# EAGLE design MRCS-Telephone-Connector-V2.0 (EAGLE 7.7.0)
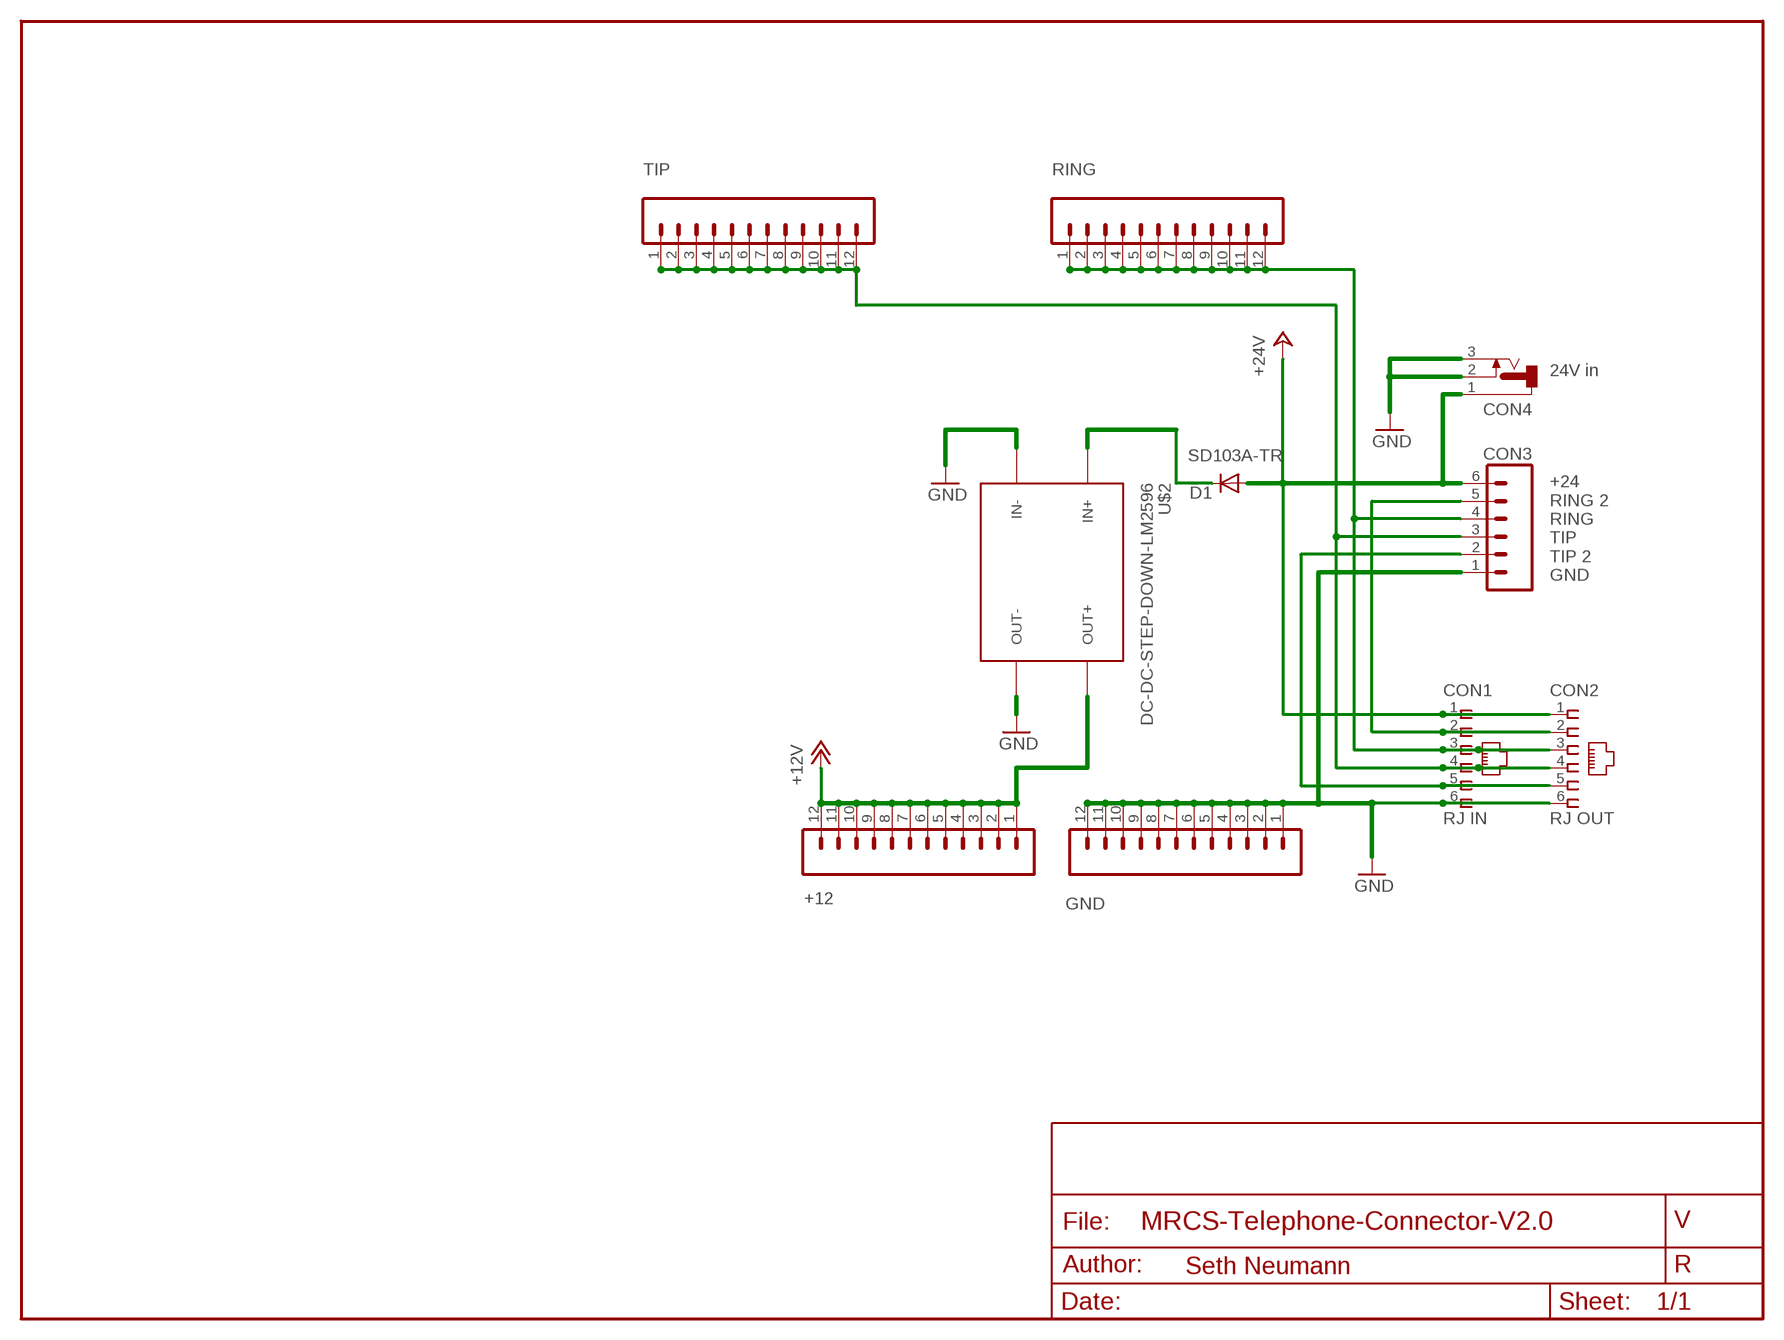
[diagram p0: schematic, sheet 1]

## Parts
+12  CONNECTOR-M12LOCK  [1X12_LOCK]
CON1  RJ IN  CONNECTOR-RJ25-43860-2-MOLEX  [RJ25-INVERTED]
CON2  RJ OUT  CONNECTOR-RJ25-43860-2-MOLEX  [RJ25-INVERTED]
CON3  CONNECTOR-M06LOCK  [1X06_LOCK]
CON4  CONNECTOR-DC-POWER-RA  [DCJ0202]
D1  SD103A-TR  DIODEPTH  [DIODE-1N4001]
GND  CONNECTOR-M12LOCK  [1X12_LOCK]
RING  CONNECTOR-M12LOCK  [1X12_LOCK]
TIP  CONNECTOR-M12LOCK  [1X12_LOCK]
U$2  DC-DC-STEP-DOWN-LM2596  [DC-DC-STEP-DOWN-LM2596]

## Nets
+12V: +12.1 +12.2 +12.3 +12.4 +12.5 +12.6 +12.7 +12.8 +12.9 +12.10 +12.11 +12.12 U$2.OUT+
+24V: CON1.1 CON2.1 CON3.6 CON4.1 D1.A
GND: CON1.6 CON2.6 CON3.1 CON4.2 CON4.3 GND.1 GND.2 GND.3 GND.4 GND.5 GND.6 GND.7 GND.8 GND.9 GND.10 GND.11 GND.12 U$2.IN- U$2.OUT-
N$1: D1.C U$2.IN+
RING: CON1.3 CON2.3 CON3.4 RING.1 RING.2 RING.3 RING.4 RING.5 RING.6 RING.7 RING.8 RING.9 RING.10 RING.11 RING.12
RING2: CON1.2 CON2.2 CON3.5
TIP: CON1.4 CON2.4 CON3.3 TIP.1 TIP.2 TIP.3 TIP.4 TIP.5 TIP.6 TIP.7 TIP.8 TIP.9 TIP.10 TIP.11 TIP.12
TIP2: CON1.5 CON2.5 CON3.2

## Notes on the sheet
- 24V in
- +24
  RING 2
  RING
  TIP
  TIP 2
  GND
- Seth Neumann

## Library data of the parts
+12 GND RING TIP = SPCoast:CONNECTOR-M12: Header 12 Standard 12-pin 0.1" header. Use with straight break away headers (SKU : PRT-00116), right angle break away headers (PRT-00553), swiss pins (PRT-00743), machine pins (PRT-00117), and female headers (PRT-00115).
CON1 CON2 = SPCoast:CONNECTOR-RJ25: AMP connector
CON3 = SPCoast:CONNECTOR-M06: Header 6 Standard 6-pin 0.1" header
CON4 = SPCoast:CONNECTOR-DC-POWER: DC POWER JACK
D1 = SPCoast:DIODE: Diode These are standard reverse protection diodes and small signal diodes. SMA package can handle up to about 1A. SOD-323 can handle about 200mA. What the SOD-323 package when ordering, there are some mfgs out there that are 5-pin packages.
U$2 = diy-modules:DC-DC-STEP-DOWN-LM2596: DC/DC Step-Down Regulator based on LM2596-ADJ chip LM2596 datasheet available here: http://www.ti.com/lit/ds/symlink/lm2596.pdf Click here to find device on ebay.com <http://www.ebay.com/sch/lm2596+power+regulator>

## Net classes
0 default: width 0.254 mm, clearance 0.254 mm
1 Power: width 0.406 mm, clearance 0.254 mm
2 Phone: width 0.305 mm, clearance 0.381 mm
3 Nasty Loads: width 0.61 mm, clearance 0.61 mm

## Board
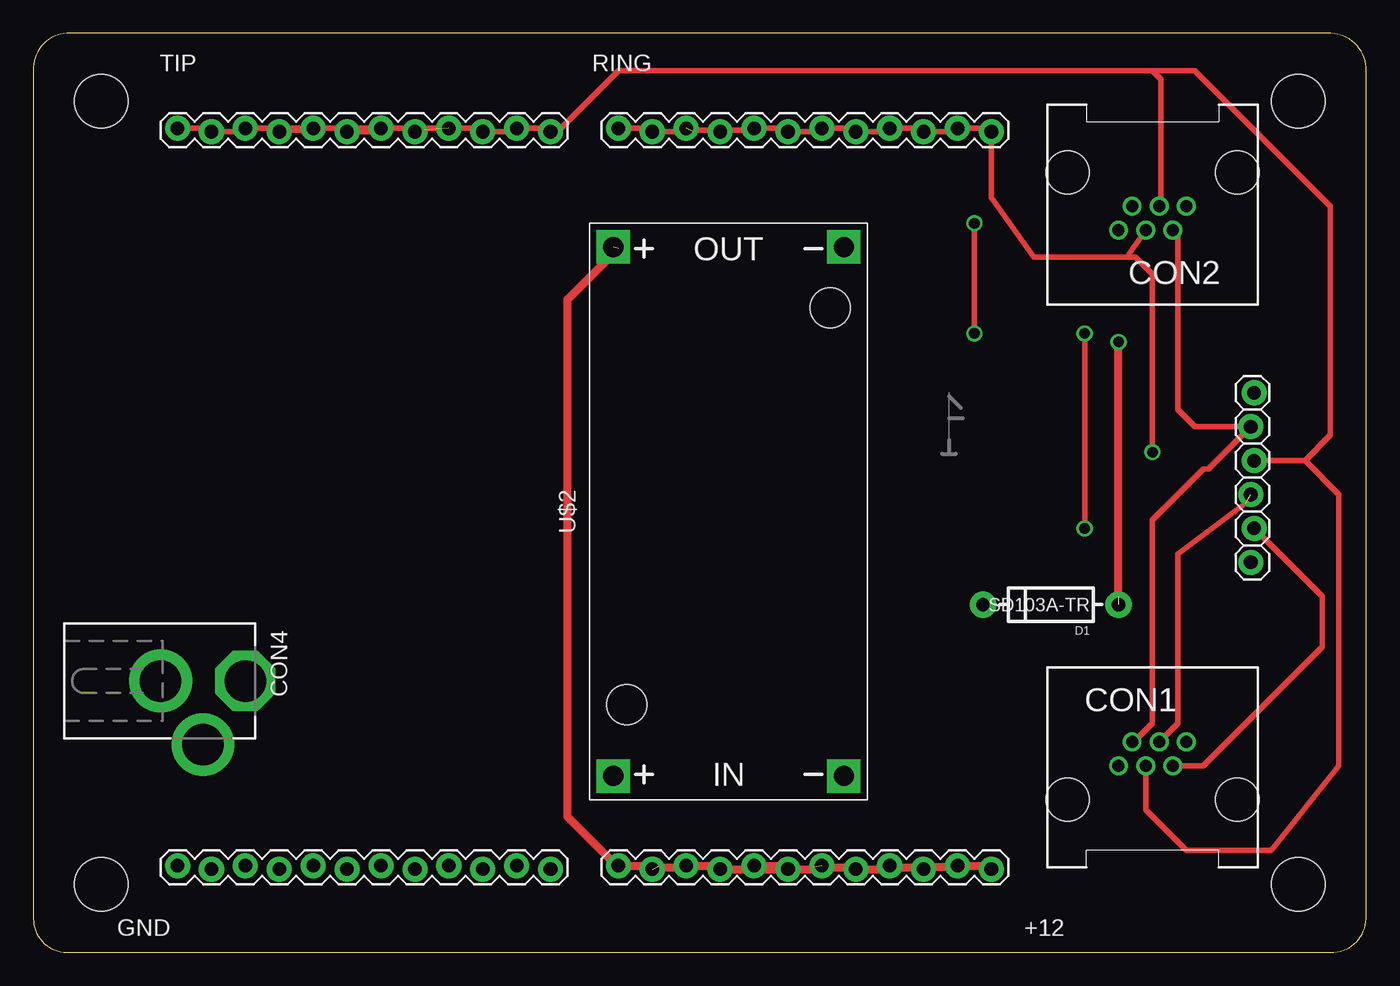
[diagram p1: board, top side]
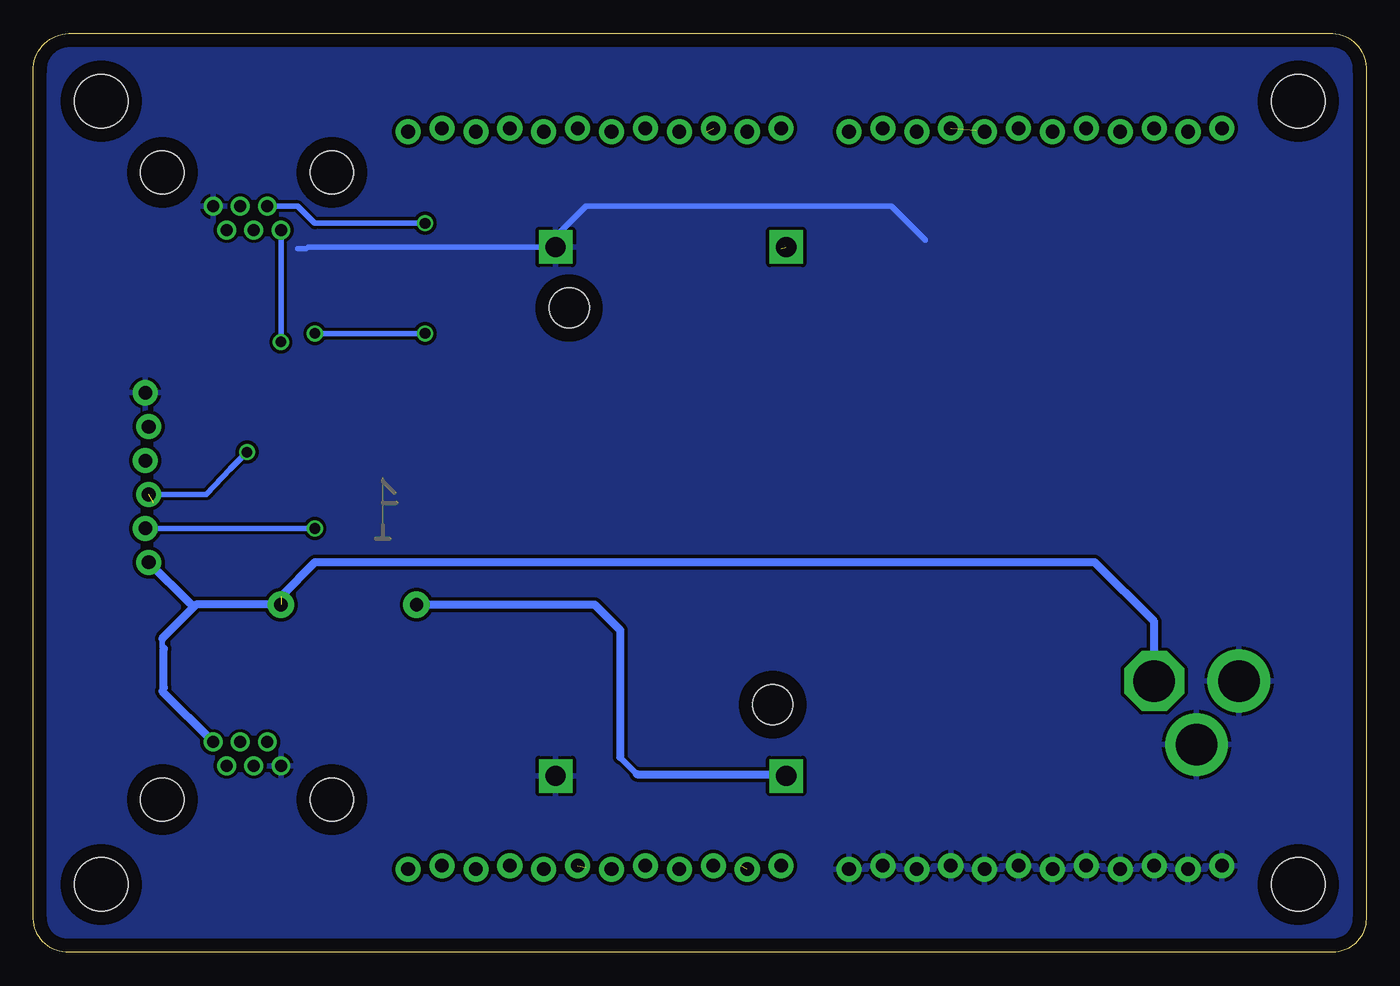
[diagram p2: board, bottom side, seen from below]

Size 99.82 x 68.83 mm. Coordinates in mm from the lower left corner, seen from the top.
Copper layers (1*16): Top 0.035mm / dielectric 1.5mm / Bottom 0.035mm
Design rules "default": minimum track width 10mil, minimum drill 24mil, track to track 8mil, track to pad 8mil, pad to pad 8mil, via to via 8mil, smd to smd 8mil, copper to edge 40mil, drill to drill 8mil, minimum pad ring 10mil, minimum via ring 8mil, stop-mask expansion 4mil, vias tented up to drill 0mil, thermal gap 10mil

### Footprints (pad centres in the part's own frame; a part is rotated, then mirrored left to right if it is on the bottom)
1X12_LOCK = drill 1.016 pad 1.88: 1 0,0.127; 2 2.54,-0.127; 3 5.08,0.127; 4 7.62,-0.127; 5 10.16,0.127; 6 12.7,-0.127; 7 15.24,0.127; 8 17.78,-0.127; 9 20.32,0.127; 10 22.86,-0.127; 11 25.4,0.127; 12 27.94,-0.127
RJ25-INVERTED = drill 0.9 pad 1.4: 1 2.54,4.318; 2 1.524,2.54; 3 0.508,4.318; 4 -0.508,2.54; 5 -1.524,4.318; 6 -2.54,2.54 | hole 3.251: -6.35,0; 6.35,0
1X06_LOCK = drill 1.016 pad 1.88: 1 0,0; 2 2.54,-0.254; 3 5.08,0; 4 7.62,-0.254; 5 10.16,0; 6 12.7,-0.254
DCJ0202 = drill 3.1 pad 4.5 octagon: 1 0,3.175 | drill 3.1 pad 4.7: 2 4.763,0; 3 0,-3.175
DIODE-1N4001 = drill 1 pad 1.981: A 5.08,0; C -5.08,0
BOARD-DINRAIL-2.71IN-MRCS = hole 4: 94.742,5.08; 5.08,63.754; 94.742,63.754; 5.08,5.08
DC-DC-STEP-DOWN-LM2596 = drill 1.5 pad 2.5 square: IN+ -19.812,8.636; IN- -19.812,-8.636; OUT+ 19.812,8.636; OUT- 19.812,-8.636 | hole 3: -14.478,7.62; 15.24,-7.62

### Placement (x,y rotation side)
+12  43.82,6.35 0 top
CON1  83.82,11.43 0 top
CON2  83.82,58.42 180 top
CON3  91.44,41.91 270 top
CON4  12.7,20.32 270 top
D1  76.2,26.04 0 top
GND  10.8,6.35 0 top
RING  43.82,61.59 0 top
TIP  10.8,61.59 0 top
U$1  [BOARD-DINRAIL-2.71IN-MRCS]  0,0 0 top
U$2  52.07,33.02 90 top
U$4  [MRCSLOGOTOP]  67.31,36.83 0 top
U$5  [MRCSLOGOBTM]  67.31,30.48 0 top
U$6  [CA-PROP65WARNING]  64.77,39.37 0 top

### Tracks (layer width: path | path; a pad name or v marks a point on that pad's centre or on a via)
+12V  (3 unrouted)
  Top 0.406: +12.1 43.69,6.48 | 46.87,6.48 46.99,6.35 | 48.77,6.35 +12.3 | +12.6 57.15,6.22 56.9,6.48 | 58.3,6.22 58.42,6.35 | 61.47,6.35 +12.8 | 64.77,6.35 64.65,6.48 +12.9 63.88,6.22 | 66.55,6.35 +12.10 66.8,6.35 | +12.11 69.22,6.35 | 71.5,6.48 +12.12 | 51.18,6.48 +12.4
  Top 0.61: 43.69,6.48 40.01,10.16 40.01,48.9 43.82,52.7 | +12.1 46.87,6.48 | 46.99,6.35 48.77,6.35 | +12.4 +12.6 | 57.15,6.22 58.3,6.22 | 58.42,6.35 61.47,6.35 | 64.77,6.35 66.55,6.35 | 69.22,6.35 66.8,6.35 | +12.11 71.5,6.48 | +12.3 51.18,6.48 | +12.8 63.88,6.22 | +12.5 56.9,6.48
  Bottom 0.406: +12.1 43.82,6.35
+24V  (via drill 0.8)  (1 unrouted)
  Top 0.61: D1.A v81.28,45.72
  Bottom 0.406: v81.28,45.72 CON2.1 | 90.05,19.81 90.17,19.68 90.17,19.56 | 87.63,26.04 88.01,26.04 | 90.05,22.73 90.17,22.86 90.17,23.5
  Bottom 0.61: 90.17,19.56 CON1.1 | D1.A 87.63,26.04 90.17,23.5 | 88.01,26.04 CON3.6 | 90.05,19.81 90.05,22.73 | CON4.1 15.88,24.77 20.32,29.21 78.74,29.21 81.28,26.67
GND
  Bottom 0.406: 79.25,52.83 U$2.OUT- 60.71,53.59 58.42,55.88 35.56,55.88 33.02,53.34 | 79.38,52.7 80.01,52.7
  pour Bottom (isolate 0.406): 0,0 99.7,0 99.7,68.58 0,68.58
  pour Bottom: 0,0 99.06,0 100.33,1.27 100.33,67.31 99.06,68.58 0,68.58
N$1
  Bottom 0.406: 55.88,14.61 54.61,13.34 | 43.56,13.34 U$2.IN+
  Bottom 0.61: D1.C 57.79,26.04 55.88,24.13 55.88,14.61 | 54.61,13.34 43.56,13.34
RING  (via drill 0.8)  (2 unrouted)
  Top 0.406: RING.1 46.1,61.72 RING.2 49.41,61.47 49.53,61.59 51.31,61.59 RING.4 51.44,61.59 53.85,61.59 RING.5 56.26,61.72 RING.6 58.8,61.47 RING.7 61.34,61.72 RING.8 63.88,61.47 RING.9 66.42,61.72 RING.10 68.96,61.47 RING.11 72.27,61.72 72.39,61.59 71.88,61.59 RING.12 71.76,56.52 74.93,52.07 81.92,52.07 | 81.92,52.07 CON2.3 | CON1.3 85.73,17.14 85.73,29.84 90.81,33.66 | 81.92,52.07 82.55,52.07 83.82,50.8 v83.82,37.47
  Bottom 0.406: v83.82,37.47 85.09,36.2 86.87,34.29 CON3.4
RING2  (via drill 0.8)
  Top 0.406: CON1.2 87.63,13.97 96.52,22.86 96.52,26.67 CON3.5 | v78.74,31.75 v78.74,46.35 | v70.49,46.35 v70.49,54.61
  Bottom 0.406: CON2.2 80.01,55.88 78.74,54.61 v70.49,54.61 | v78.74,46.35 v70.49,46.35 | v78.74,31.75 CON3.5
TIP  (1 unrouted)
  Top 0.406: TIP.1 13.08,61.72 TIP.2 15.62,61.47 TIP.3 TIP.9 33.4,61.72 TIP.10 36.71,61.47 36.83,61.59 36.32,61.59 TIP.11 39.25,61.72 39.37,61.59 38.86,61.59 TIP.12 39.25,61.47 43.82,66.04 83.82,66.04 | TIP.4 18.42,61.59 20.83,61.59 TIP.5 23.24,61.72 TIP.6 25.78,61.47 TIP.7 29.09,61.72 29.21,61.59 28.7,61.59 TIP.8 | 83.82,66.04 84.46,65.41 84.46,56.01 CON2.4 | 83.82,66.04 87,66.04 97.16,55.88 97.16,38.73 95.25,36.83 | CON1.4 83.31,10.67 86.36,7.62 92.71,7.62 97.79,13.97 97.79,34.29 95.25,36.83 | 95.25,36.83 CON3.3
TIP2
  Top 0.406: CON2.5 85.73,53.72 85.73,40.64 87,39.37 CON3.2 88.01,36.2 87.63,36.2 83.82,32.38 83.82,17.14 82.43,15.75 CON1.5

### Text on the board
tDocu: Telephone Connector / Revision 2.0 / Seth Neumann / Sept 29, 2020 | GND / TIP2 / TIP / RING / RNG2 / +24 | 24VDC in
bDocu: Telephone Connector / Revision 2.0 / Seth Neumann / September 29, 2020